# EAGLE schematic Analog Drum (EAGLE 9.2.2)
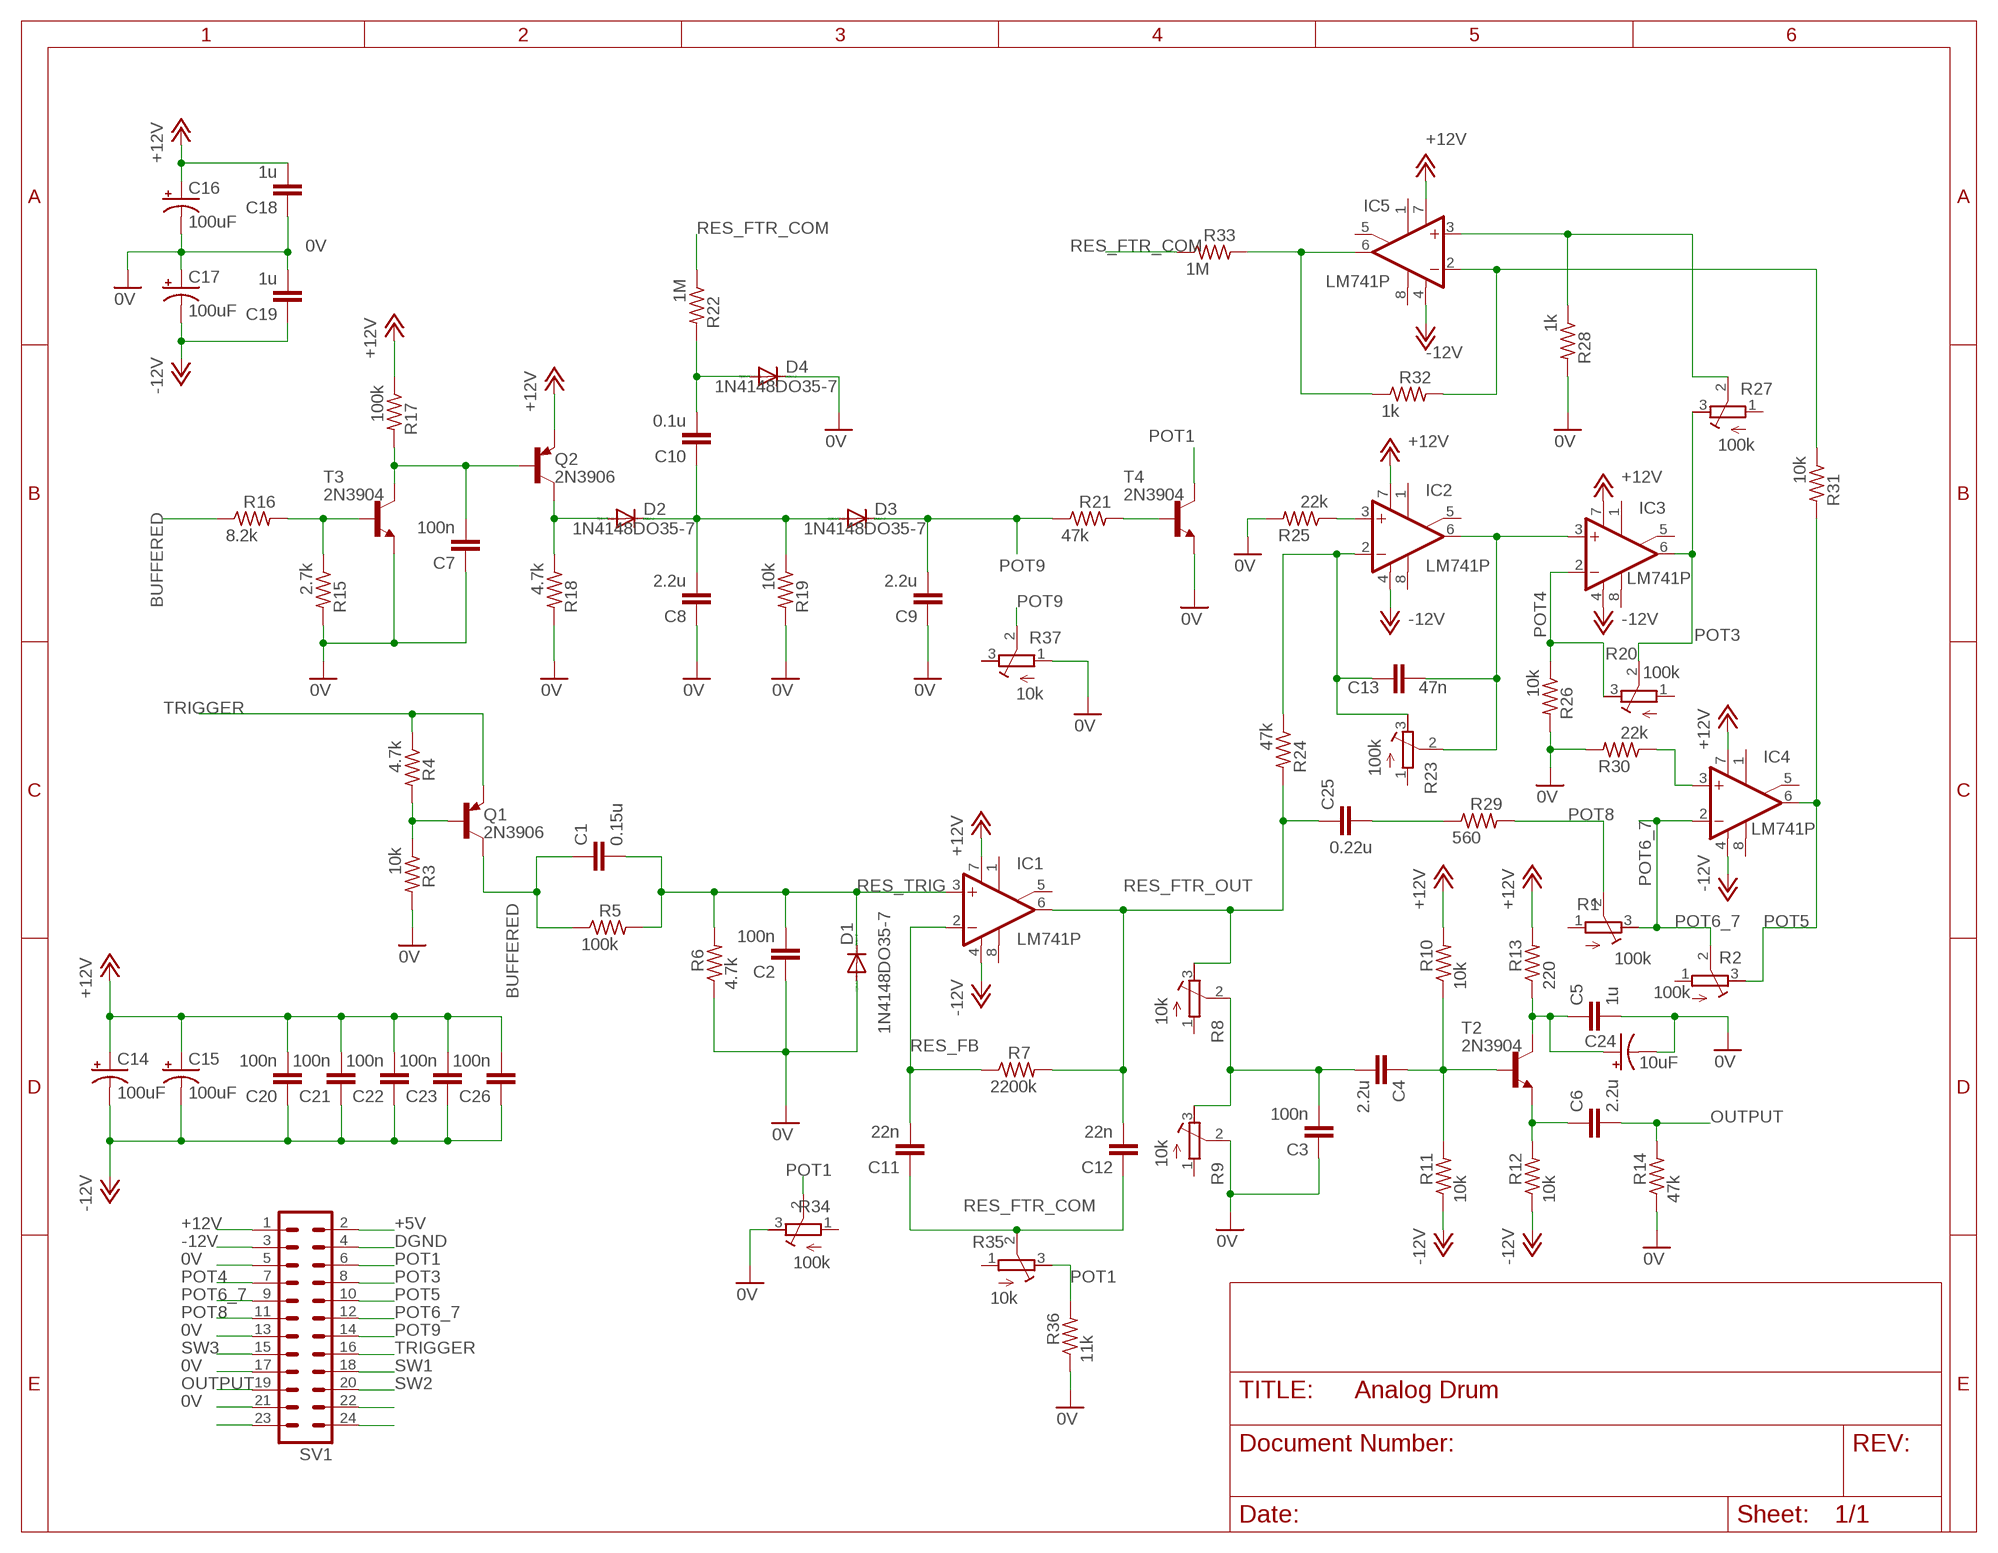
[diagram p0: schematic, sheet 1]

## Parts
C1  0.15u  C-EU050-024X044  [C050-024X044]
C2  100n  C-EU050-024X044  [C050-024X044]
C3  100n  C-EU050-024X044  [C050-024X044]
C4  2.2u  C-EU050-024X044  [C050-024X044]
C5  1u  C-EU050-024X044  [C050-024X044]
C6  2.2u  C-EU050-024X044  [C050-024X044]
C7  100n  C-EU050-024X044  [C050-024X044]
C8  2.2u  C-EU050-024X044  [C050-024X044]
C9  2.2u  C-EU050-024X044  [C050-024X044]
C10  0.1u  C-EU050-024X044  [C050-024X044]
C11  22n  C-EU050-024X044  [C050-024X044]
C12  22n  C-EU050-024X044  [C050-024X044]
C13  47n  C-EU050-024X044  [C050-024X044]
C14  100uF  CPOL-USE5-8.5  [E5-8,5]
C15  100uF  CPOL-USE5-8.5  [E5-8,5]
C16  100uF  CPOL-USE5-8.5  [E5-8,5]
C17  100uF  CPOL-USE5-8.5  [E5-8,5]
C18  1u  C-EU050-024X044  [C050-024X044]
C19  1u  C-EU050-024X044  [C050-024X044]
C20  100n  C-EU050-024X044  [C050-024X044]
C21  100n  C-EU050-024X044  [C050-024X044]
C22  100n  C-EU050-024X044  [C050-024X044]
C23  100n  C-EU050-024X044  [C050-024X044]
C24  10uF  CPOL-USE2.5-6  [E2,5-6]
C25  0.22u  C-EU050-024X044  [C050-024X044]
C26  100n  C-EU050-024X044  [C050-024X044]
D1  1N4148DO35-7  [DO35-7]
D2  1N4148DO35-7  [DO35-7]
D3  1N4148DO35-7  [DO35-7]
D4  1N4148DO35-7  [DO35-7]
IC1  LM741P  [DIL08]
IC2  LM741P  [DIL08]
IC3  LM741P  [DIL08]
IC4  LM741P  [DIL08]
IC5  LM741P  [DIL08]
Q1  2N3906  [TO92]
Q2  2N3906  [TO92]
R1  100k  R-TRIMM64W  [RTRIM64W]
R2  100k  R-TRIMM64W  [RTRIM64W]
R3  10k  R-US_0207/10  [0207/10]
R4  4.7k  R-US_0207/10  [0207/10]
R5  100k  R-US_0207/10  [0207/10]
R6  4.7k  R-US_0207/10  [0207/10]
R7  2200k  R-US_0207/10  [0207/10]
R8  10k  R-TRIMM64W  [RTRIM64W]
R9  10k  R-TRIMM64W  [RTRIM64W]
R10  10k  R-US_0207/10  [0207/10]
R11  10k  R-US_0207/10  [0207/10]
R12  10k  R-US_0207/10  [0207/10]
R13  220  R-US_0207/10  [0207/10]
R14  47k  R-US_0207/10  [0207/10]
R15  2.7k  R-US_0207/10  [0207/10]
R16  8.2k  R-US_0207/10  [0207/10]
R17  100k  R-US_0207/10  [0207/10]
R18  4.7k  R-US_0207/10  [0207/10]
R19  10k  R-US_0207/10  [0207/10]
R20  100k  R-TRIMM64W  [RTRIM64W]
R21  47k  R-US_0207/10  [0207/10]
R22  1M  R-US_0207/10  [0207/10]
R23  100k  R-TRIMM64W  [RTRIM64W]
R24  47k  R-US_0207/10  [0207/10]
R25  22k  R-US_0207/10  [0207/10]
R26  10k  R-US_0207/10  [0207/10]
R27  100k  R-TRIMM64W  [RTRIM64W]
R28  1k  R-US_0207/10  [0207/10]
R29  560  R-US_0207/10  [0207/10]
R30  22k  R-US_0207/10  [0207/10]
R31  10k  R-US_0207/10  [0207/10]
R32  1k  R-US_0207/10  [0207/10]
R33  1M  R-US_0207/10  [0207/10]
R34  100k  R-TRIMM64W  [RTRIM64W]
R35  10k  R-TRIMM64W  [RTRIM64W]
R36  11k  R-US_0207/10  [0207/10]
R37  10k  R-TRIMM64W  [RTRIM64W]
SV1  MA12-2  [MA12-2]
T2  2N3904  [TO92]
T3  2N3904  [TO92]
T4  2N3904  [TO92]

## Nets
0V: C2.1 C3.1 C5.2 C7.1 C8.1 C9.1 C16.- C17.+ C18.1 C19.2 C24.- D1.A D4.C R3.2 R6.1 R9.2(S) R14.1 R15.2 R18.2 R19.2 R25.2 R26.2 R28.2 R30.2 R34.3(E) R36.1 R37.1(A) SV1.5 SV1.13 SV1.17 SV1.21 T3.3(E) T4.3(E)
+5V: SV1.2
+12V: C14.+ C15.+ C16.+ C18.2 C20.2 C21.2 C22.2 C23.2 C26.2 IC1.7(V+) IC2.7(V+) IC3.7(V+) IC4.7(V+) IC5.7(V+) Q2.3(E) R10.2 R13.2 R17.1 SV1.1
-12V: C14.- C15.- C17.- C19.1 C20.1 C21.1 C22.1 C23.1 C26.1 IC1.4(V-) IC2.4(V-) IC3.4(V-) IC4.4(V-) IC5.4(V-) R11.1 R12.1 SV1.3
BUFFERED: C1.1 Q1.1(C) R5.1 R16.1
DGND: SV1.4
N$1: C25.2 R29.1
N$2: IC4.3(+IN) R30.1
N$3: Q1.2(B) R3.1 R4.2
N$4: C10.2 D4.A R22.2
N$7: IC2.3(+IN) R25.1
N$8: C3.2 C4.2 R8.2(S) R9.3(E)
N$9: C4.1 R10.1 R11.2 T2.2(B)
N$10: C6.1 R12.2 T2.3(E)
N$11: C5.1 C24.+ R13.1 T2.1(C)
N$12: C13.2 IC2.2(-IN) R23.3(E) R24.1
N$13: R15.1 R16.2 T3.2(B)
N$14: C7.2 Q2.2(B) R17.2 T3.1(C)
N$15: D2.A Q2.1(C) R18.1
N$16: C8.2 C10.1 D2.C D3.A R19.1
N$18: R21.2 T4.2(B)
N$19: C13.1 IC2.6(OUT) IC3.3(+IN) R23.2(S)
N$22: IC5.3(+IN) R27.2(S) R28.1
N$24: SV1.23
N$25: SV1.24
N$26: SV1.22
N$29: IC5.2(-IN) R31.1 R32.2
N$31: IC5.6(OUT) R32.1 R33.2
OUTPUT: C6.2 R14.2 SV1.19
POT1: R34.2(S) R35.3(E) R36.2 SV1.6 T4.1(C)
POT3: IC3.6(OUT) R20.2(S) R27.3(E) SV1.8
POT4: IC3.2(-IN) R20.3(E) R26.1 SV1.7
POT5: IC4.6(OUT) R2.3(E) R31.2 SV1.10
POT6_7: IC4.2(-IN) R1.3(E) R2.2(S) SV1.9 SV1.12
POT8: R1.2(S) R29.2 SV1.11
POT9: C9.2 D3.C R21.1 R37.2(S) SV1.14
RES_FB: C11.2 IC1.2(-IN) R7.1
RES_FTR_COM: C11.1 C12.1 R22.1 R33.1 R35.2(S)
RES_FTR_OUT: C12.2 C25.1 IC1.6(OUT) R7.2 R8.3(E) R24.2
RES_TRIG: C1.2 C2.2 D1.C IC1.3(+IN) R5.2 R6.2
SW1: SV1.18
SW2: SV1.20
SW3: SV1.15
TRIGGER: Q1.3(E) R4.1 SV1.16
Unconnected: IC1.1(ON1) IC1.5(ON2) IC1.8(OPT) IC2.1(ON1) IC2.5(ON2) IC2.8(OPT) IC3.1(ON1) IC3.5(ON2) IC3.8(OPT) IC4.1(ON1) IC4.5(ON2) IC4.8(OPT) IC5.1(ON1) IC5.5(ON2) IC5.8(OPT) R1.1(A) R2.1(A) R8.1(A) R9.1(A) R20.1(A) R23.1(A) R27.1(A) R34.1(A) R35.1(A) R37.3(E)

## Library data of the parts
C1-C13 C18-C23 C25 C26 = resistor:C-EU: CAPACITOR, European symbol
C14-C17 C24 = rcl:CPOL-US: POLARIZED CAPACITOR, American symbol; SPICEPREFIX: C
D1-D4 = diode:1N4148: DIODE high speed (Philips)
IC1-IC5 = linear:*741: OP AMP
Q1 Q2 = transistor-pnp:2N3906: PNP Transistor
R1 R2 R8 R9 R20 R23 R27 R34 R35 R37 = rcl:R-TRIMM: Trimm resistor; SPICEMODEL: X; SPICEPREFIXL: POT
R3-R7 R10-R19 R21 R22 R24-R26 R28-R33 R36 = resistor:R-US_: RESISTOR, American symbol
SV1 = con-lstb:MA12-2: PIN HEADER; OC_FARNELL: unknown; OC_NEWARK: unknown
T2-T4 = transistor:2N3904: NPN TRANSISTOR